# Altium schematic sheet Errata+TOC.SchDoc: Errata and Table of Contents
size 279 x 215 mm; DrawnBy: Connor Dack; Engineer: Connor Dack; DocumentNumber: 1; Revision: 1.0; SheetNumber: 1; SheetTotal: 11
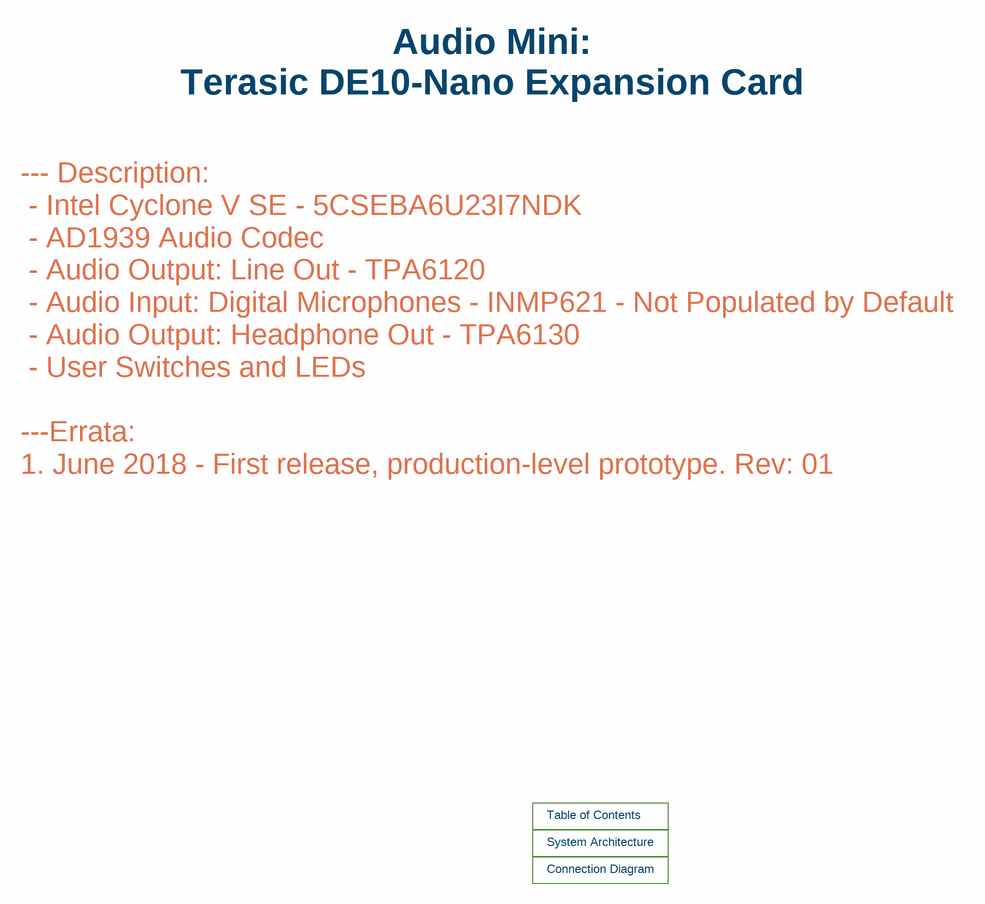
[diagram p0: Errata+TOC.SchDoc]

## Sub-sheets
Connection Diagram = TopLevel.SchDoc: no entries
System Architecture = System_Architecture.SchDoc: no entries
Table of Contents = ToC.SchDoc: no entries

## Notes on the sheet
- Audio Mini:
  Terasic DE10-Nano Expansion Card
- --- Description:
  - Intel Cyclone V SE - 5CSEBA6U23I7NDK
  - AD1939 Audio Codec
  - Audio Output: Line Out - TPA6120
  - Audio Input: Digital Microphones - INMP621 - Not Populated by Default
  - Audio Output: Headphone Out - TPA6130
  - User Switches and LEDs
  ---Errata:
  1. June 2018 - First release, production-level prototype. Rev: 01
- Title:
- Rev:
- Sheet:
- Date:
- of
- Time:
- Size:
- 11 x 8.5 Inches
- Engineer:
- File:
- This document contains confidential and proprietary information belonging to flat earth of Bozeman, Montana.
  This information can not be disclosed to anyone outside of flat earth without written permission from flat earth.